# EAGLE design Un_Battery_V2.1 (EAGLE 7.1.0)
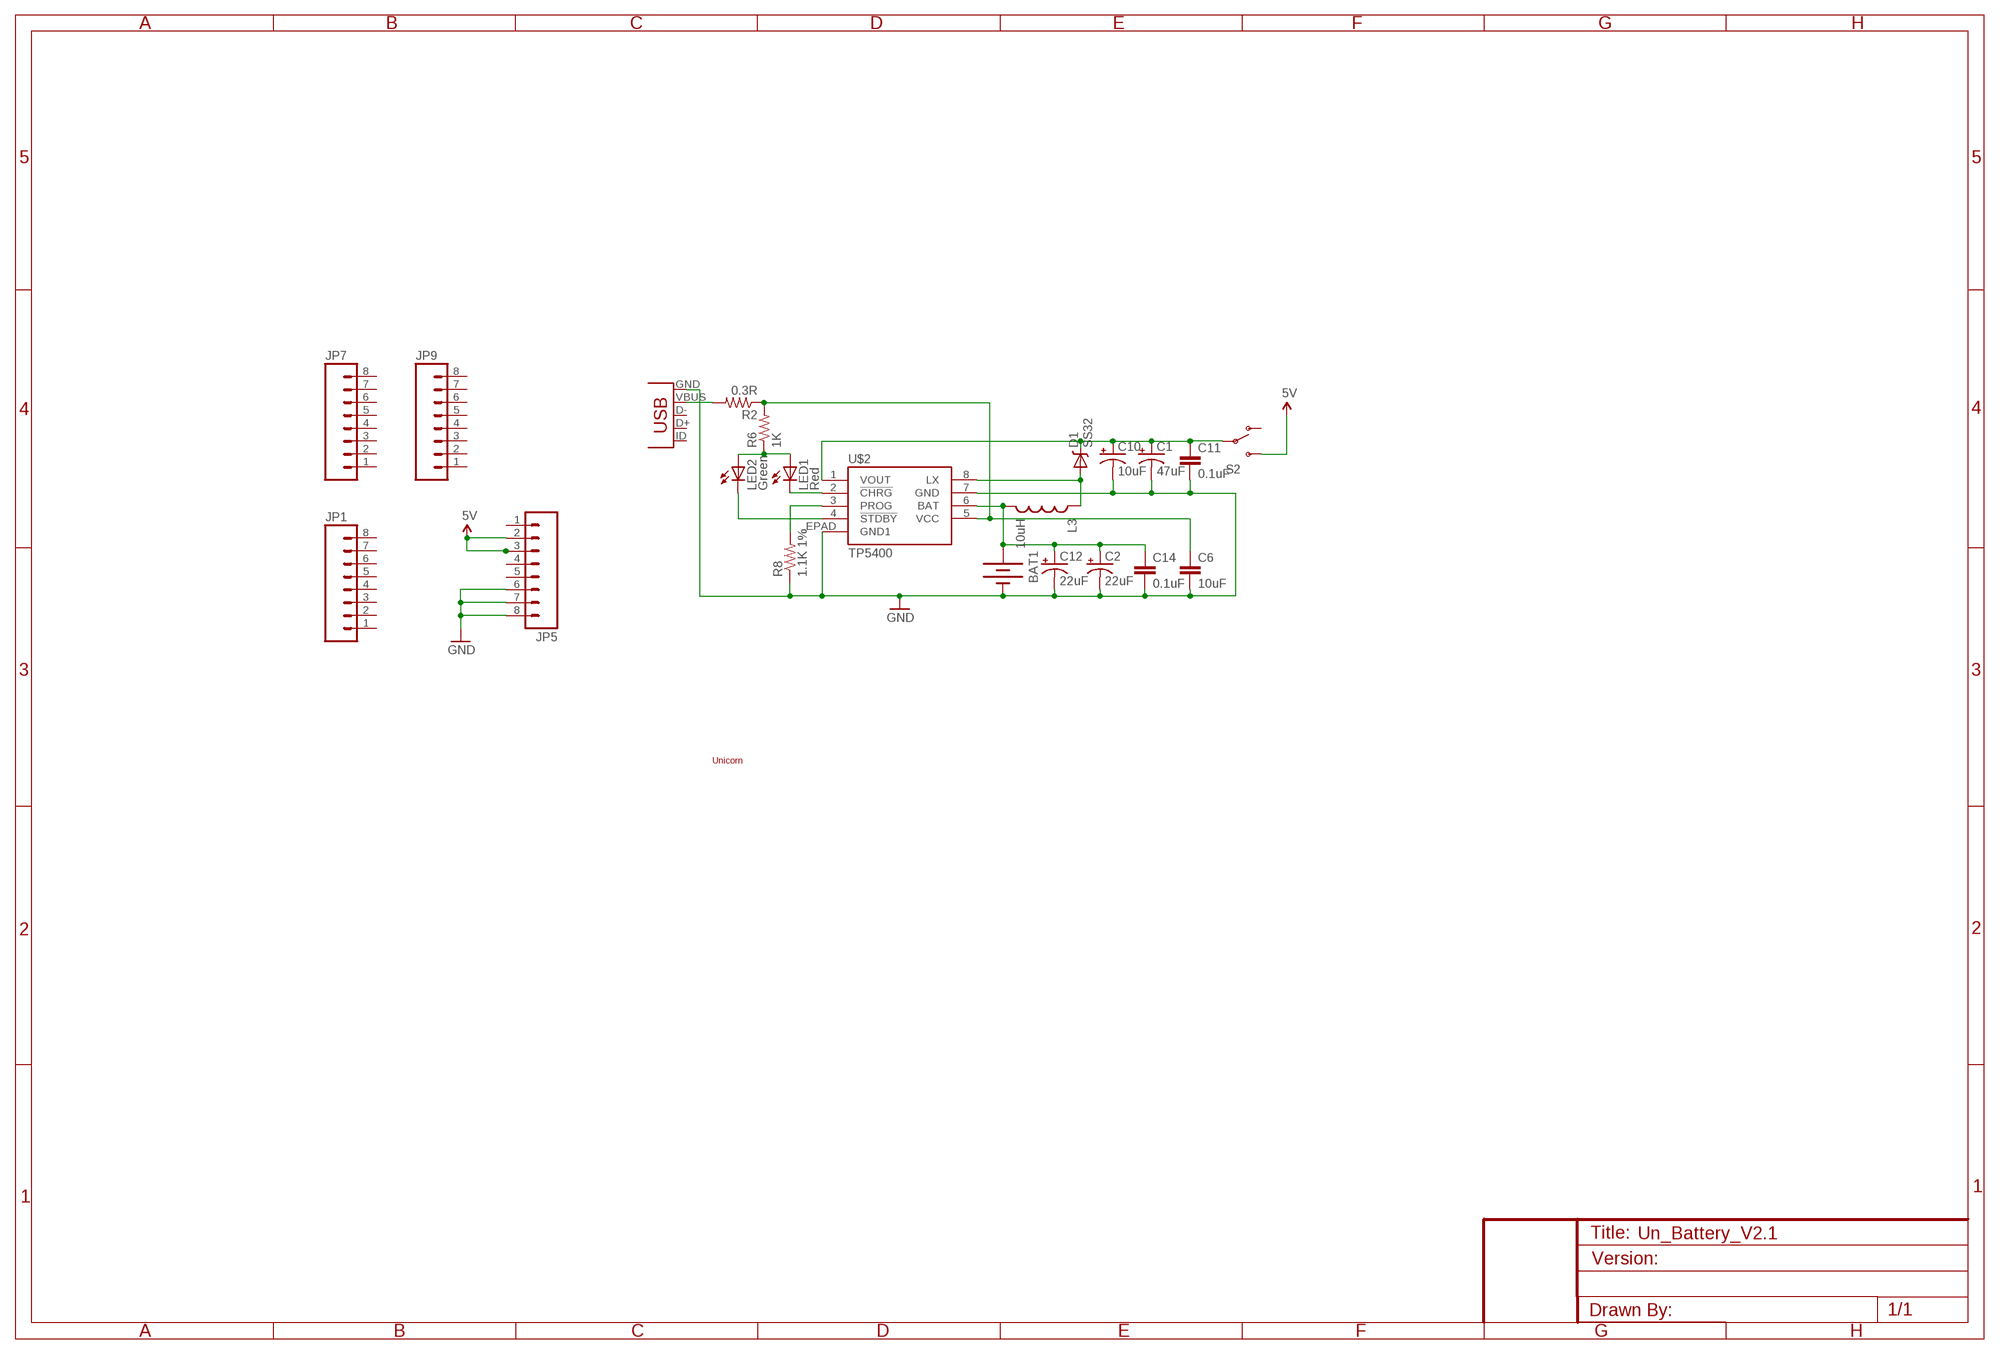
[diagram p0: schematic, sheet 1]

## Parts
BAT1  BATTERYLIPO2  [BATTERY-LIPO2]
C1  47uF  CAP_POL1206  [EIA3216]
C2  22uF  CAP_POL1206  [EIA3216]
C6  10uF  CAP1206  [1206]
C10  10uF  CAP_POL1206  [EIA3216]
C11  0.1uF  CAP0603-CAP  [0603-CAP]
C12  22uF  CAP_POL1206  [EIA3216]
C14  0.1uF  CAP0603-CAP  [0603-CAP]
D1  SS32  DIODE-SCHOTTKY_  [SMA-DIODE]
JP1  M081X08  [1X08]
JP5  M081X08  [1X08]
JP7  M081X08  [1X08]
JP9  M081X08  [1X08]
L3  10uH  INDUCTOR_CR32  [CR32]
LED1  Red  LED0603  [LED-0603]
LED2  Green  LED0603  [LED-0603]
R2  0.3R  RESISTOR1206  [1206]
R6  1K  RESISTOR0603-RES  [0603-RES]
R8  1.1K 1%  RESISTOR0603-RES  [0603-RES]
S2  SWITCH-SPST  [SWITCH-SPDT2]
U$2  TP5400  [SO08-EPAD]
U$6  USB_5-SMD  [USB-MINIB]
U$7  UNICORN_1  [UNICORN_1]

## Nets
5V: JP5.2 JP5.3 S2.3(S)
GND: BAT1.- C1.C(-) C2.C(-) C6.2 C10.C(-) C11.2 C12.C(-) C14.2 JP5.6 JP5.7 JP5.8 R8.1 U$2.7(GND) U$2.EPAD(GND1) U$6.GND
N$1: R2.2 U$6.VBUS
N$2: C6.1 R2.1 R6.2 U$2.5(VCC)
N$3: LED1.A LED2.A R6.1
N$5: LED2.C U$2.4(!STDBY)
N$6: LED1.C U$2.2(!CHRG)
N$7: C1.A(+) C10.A(+) C11.1 D1.C S2.2(P) U$2.1(VOUT)
N$12: R8.2 U$2.3(PROG)
N$13: D1.A L3.P$1 U$2.8(LX)
N$19: BAT1.+ C2.A(+) C12.A(+) C14.1 L3.P$2 U$2.6(BAT)
N$28: JP5.1
N$31: JP5.4
Unconnected: JP1.1 JP1.2 JP1.3 JP1.4 JP1.5 JP1.6 JP1.7 JP1.8 JP5.5 JP7.1 JP7.2 JP7.3 JP7.4 JP7.5 JP7.6 JP7.7 JP7.8 JP9.1 JP9.2 JP9.3 JP9.4 JP9.5 JP9.6 JP9.7 JP9.8 S2.1(O) U$6.D+ U$6.D- U$6.ID(USBID)

## Library data of the parts
BAT1 = 2SparkFun:BATTERY: Battery Holders Various common sizes : AA, AAA, 20mm coin cell and 12mm coin cell.
C1 C2 C10 C12 = 2SparkFun:CAP_POL: Capacitor Polarized These are standard SMD and PTH capacitors. Normally 10uF, 47uF, and 100uF in electrolytic and tantalum varieties. Always verify the external diameter of the through hole cap, it varies with capacity, voltage, and manufacturer. The EIA devices should be standard.
C6 C11 C14 = 2SparkFun:CAP: Capacitor Standard 0603 ceramic capacitor, and 0.1" leaded capacitor.
D1 = 2SparkFun:DIODE-SCHOTTKY
JP1 JP5 JP7 JP9 = 2SparkFun:M08: Header 8 Standard 8-pin 0.1" header. Use with straight break away headers (SKU : PRT-00116), right angle break away headers (PRT-00553), swiss pins (PRT-00743), machine pins (PRT-00117), and female headers (PRT-00115).
L3 = 2SparkFun:INDUCTOR: Inductors Basic Inductor/Choke - 0603 and 1206. Footprints are not proven and vary greatly between part numbers.
LED1 LED2 = 2SparkFun:LED: LEDs Standard schematic elements and footprints for 5mm, 3mm, 1206, and 0603 sized LEDs. 5mm - Spark Fun Electronics SKU : COM-00529 (and others)
R2 R6 R8 = 2SparkFun:RESISTOR: Resistor Basic schematic elements and footprints for 0603, 1206, and PTH resistors.
S2 = 2SparkFun:SWITCH-SPST: SPST Switch Simple slide switch. Spark Fun Electronics SKU : COM-00102
U$2 = 2SparkFun:TP5400
U$6 = 2SparkFun:USB_5
U$7 = 2SparkFun:UNICORN

## Net classes
0 default: clearance 0.205 mm
1 power: width 0.61 mm, drill 0.61 mm, clearance 0.254 mm
2 gnd: width 0.305 mm, drill 0.381 mm, clearance 0.254 mm
3 usbvcc: width 0.508 mm, drill 0.61 mm, clearance 0.254 mm
4 aref: width 0.406 mm, drill 0.61 mm, clearance 0.254 mm

## Board
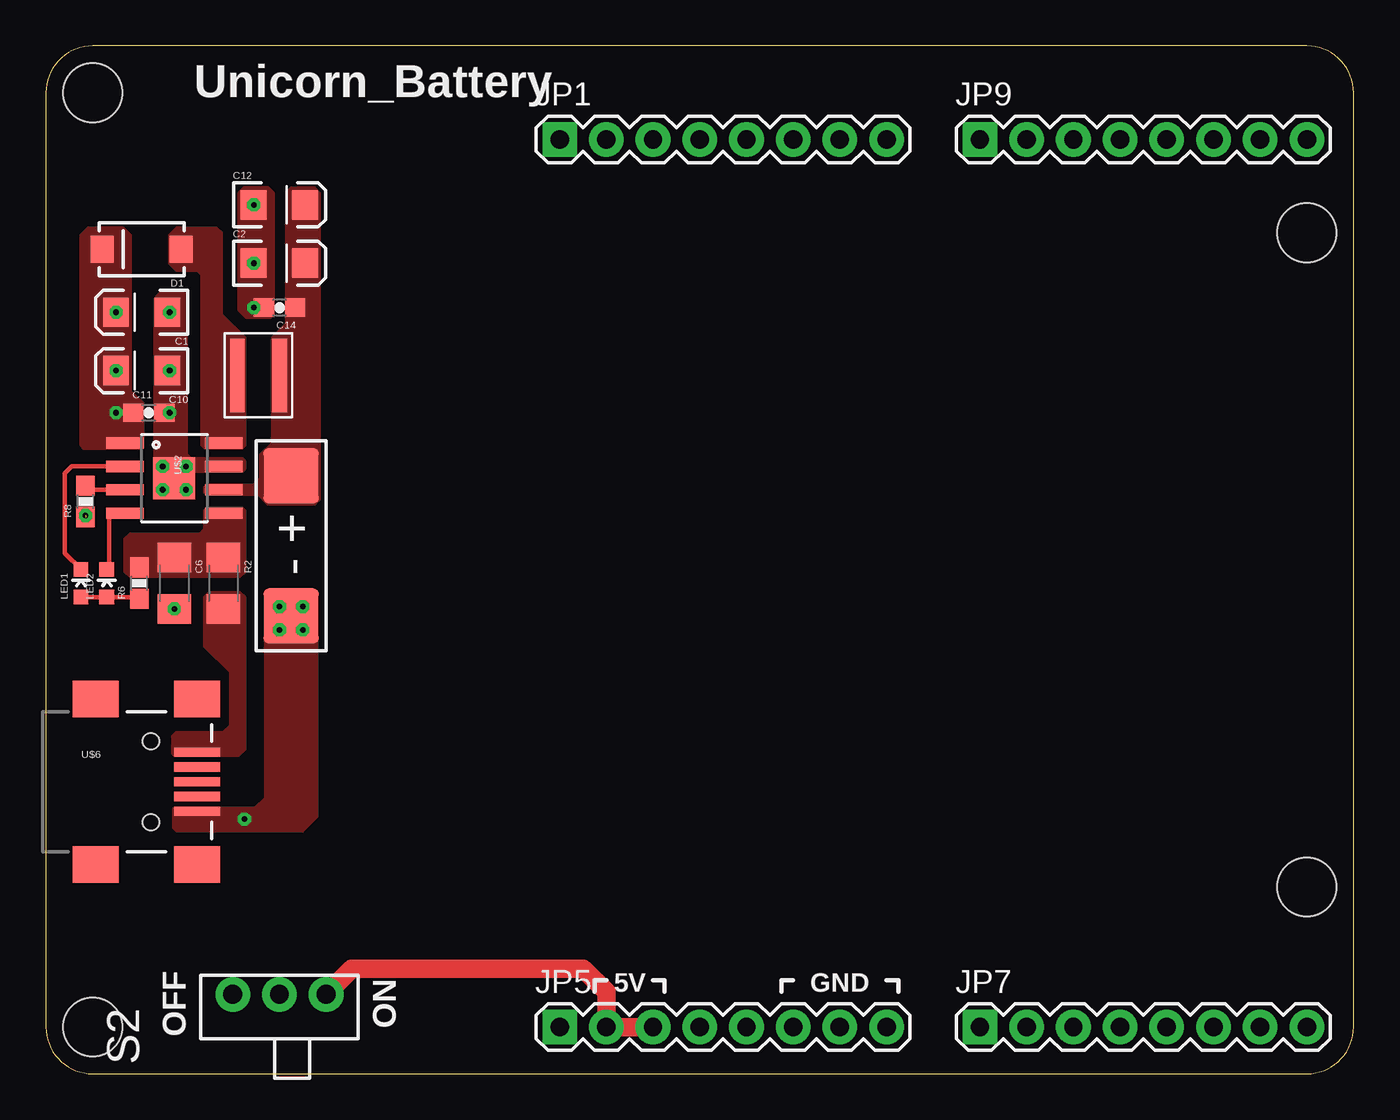
[diagram p1: board, top side]
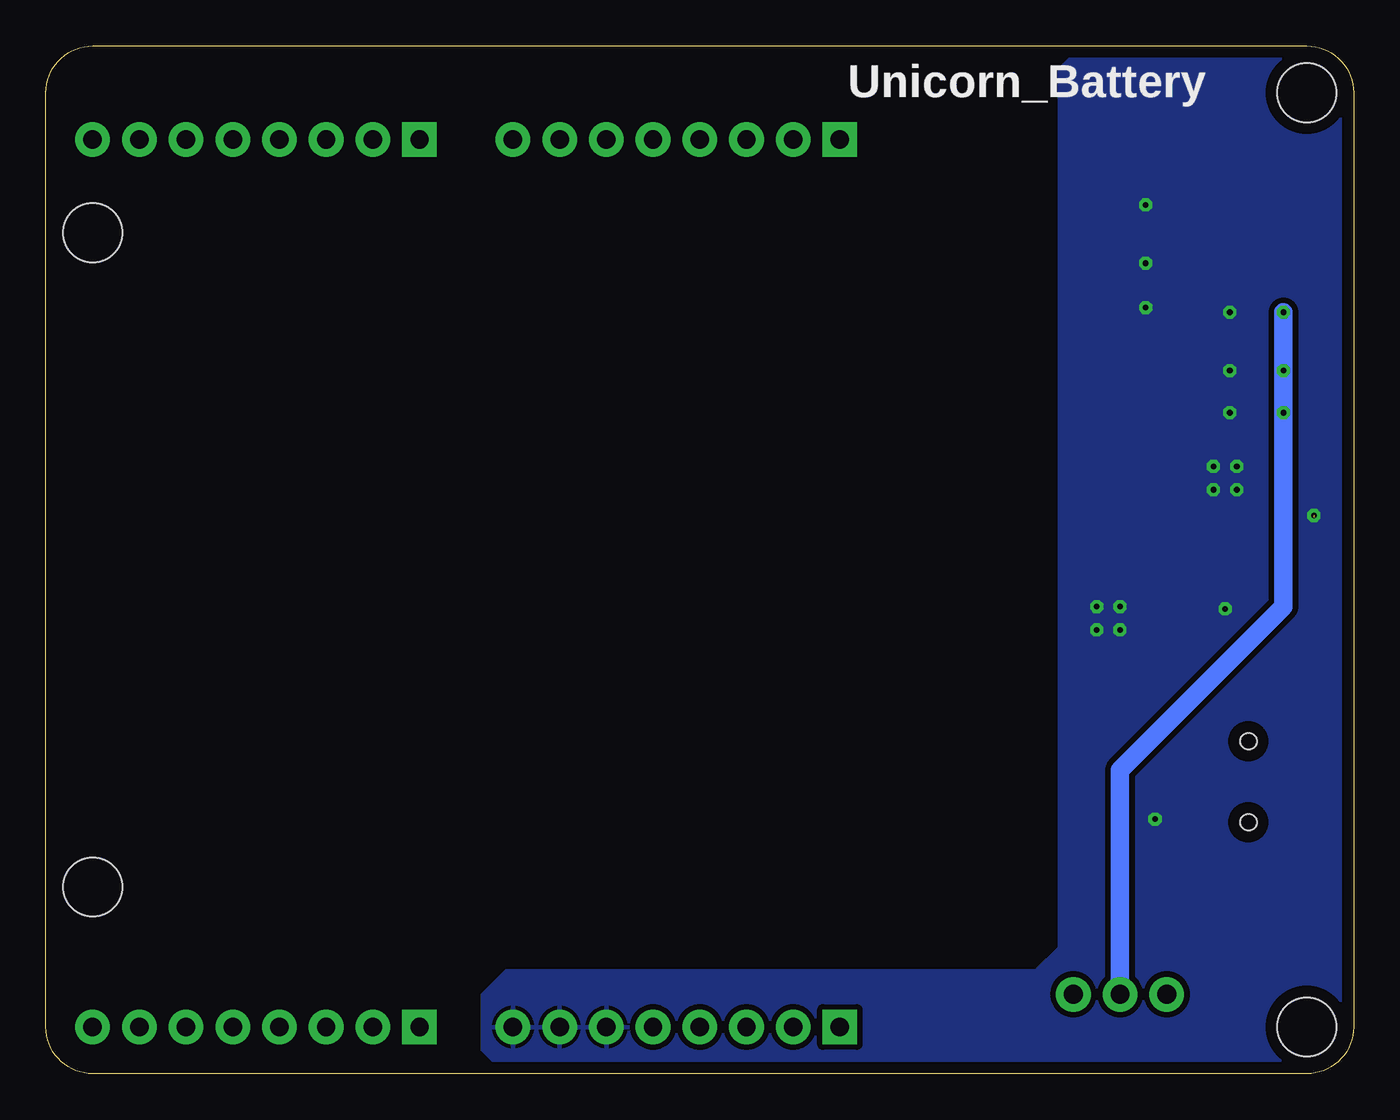
[diagram p2: board, bottom side, seen from below]

Size 71.12 x 55.88 mm. Coordinates in mm from the lower left corner, seen from the top.
Copper layers (1*16): Top 0.035mm / dielectric 1.5mm / Bottom 0.035mm
Design rules "yun": minimum track width 8mil, minimum drill 15mil, track to track 8mil, track to pad 8mil, pad to pad 8mil, via to via 8mil, smd to smd 8mil, copper to edge 25mil, drill to drill 8mil, minimum pad ring 10mil, minimum via ring 8mil, stop-mask expansion 4mil, vias tented up to drill 20mil, thermal gap 8mil

### Footprints (pad centres in the part's own frame; a part is rotated, then mirrored left to right if it is on the bottom)
BATTERY-LIPO2 = smd 3 x 3: + -3.81,0; - 3.81,0
EIA3216 = smd 1.4 x 1.6: A 1.4,0; C -1.4,0
1206 = smd 1.6 x 1.8: 1 -1.4,0; 2 1.4,0
0603-CAP = smd 1.1 x 1: 1 -0.85,0; 2 0.85,0
SMA-DIODE = smd 1.27 x 1.47: A -2.15,0; C 2.15,0
1X08 = drill 1 pad 1.88 square: 1 0,0 | drill 1 pad 1.88: 2 2.54,0; 3 5.08,0; 4 7.62,0; 5 10.16,0; 6 12.7,0; 7 15.24,0; 8 17.78,0
CR32 = smd 0.8 x 4: P$1 -1.15,0; P$2 1.15,0
LED-0603 = smd 0.8 x 0.8: A 0,-0.75; C 0,0.75
0603-RES = smd 1.1 x 1: 1 -0.85,0; 2 0.85,0
SWITCH-SPDT2 = drill 1.016 pad 1.88: 1 0,2.54; 2 0,0; 3 0,-2.54
SO08-EPAD = smd 0.61 x 2.057: 1 -1.905,-2.692; 2 -0.635,-2.692; 3 0.635,-2.692; 4 1.905,-2.692; 5 1.905,2.692; 6 0.635,2.692; 7 -0.635,2.692; 8 -1.905,2.692 | smd 2.286 x 2.286: EPAD 0,0
USB-MINIB = smd 2.5 x 0.5: D+ 2.5,0; D- 2.5,0.8; GND 2.5,-1.6; ID 2.5,-0.8; VBUS 2.5,1.6 | smd 2.5 x 2: MTN1 -3,4.5; MTN2 2.5,4.5; MTN3 -3,-4.5; MTN4 2.5,-4.5 | hole 0.9: 0,2.2; 0,-2.2
UNICORN_1 = hole 3.2: -33.02,-25.4; 33.02,17.78; 33.02,-17.78; -33.02,25.4

### Placement (x,y rotation side)
BAT1  13.33,28.7 270 top
C1  5.21,41.4 180 top
C2  12.7,44.07 0 top
C6  6.98,26.67 270 top
C10  5.21,38.23 180 top
C11  5.59,35.94 0 top
C12  12.7,47.24 0 top
C14  12.7,41.66 180 top
D1  5.21,44.83 180 top
JP1  27.94,50.8 0 top
JP5  27.94,2.54 0 top
JP7  50.8,2.54 0 top
JP9  50.8,50.8 0 top
L3  11.56,37.97 0 top
LED1  1.91,26.67 0 top
LED2  3.3,26.67 0 top
R2  9.65,26.67 270 top
R6  5.08,26.67 90 top
R8  2.16,31.11 90 top
S2  12.7,4.32 90 top
U$2  6.98,32.38 270 top
U$6  5.72,15.88 0 top
U$7  35.56,27.94 0 top

### Tracks (layer width: path | path; a pad name or v marks a point on that pad's centre or on a via)
5V
  Top 1.016: JP5.3 JP5.2 30.48,4.45 29.21,5.71 16.64,5.71 S2.3
GND  (via drill 0.3)  (2 unrouted)
  other vias: 12.7,25.4 12.7,24.13 13.97,24.13 13.97,25.4 6.35,33.02 6.73,38.23 6.73,35.94 6.98,25.27 7.62,33.02 7.62,31.75 6.35,31.75 6.73,41.4 11.3,47.24 11.3,44.07 2.16,30.35 10.8,13.84 11.3,41.66
  pour Bottom (isolate 0.305, rank 2): 0,55.88 14.73,55.88 16,54.61 16,6.86 17.27,5.59 46.1,5.59 47.37,4.32 47.37,1.27 46.1,0 0,0
  pour Top (isolate 0.305, no thermals): 8,32.77 6.98,31.37 8,31.37
  pour Top (isolate 0.305, no thermals): 7.62,33.68 7.87,33.43 10.67,33.43 10.8,33.3 10.8,32.89 10.67,32.77 6.6,32.77 6.35,33.02 5.94,33.5 5.94,42.14 6.3,42.55 7.37,42.55 7.62,42.29
  pour Top (isolate 0.305, no thermals): 10.92,41.15 10.54,41.53 10.54,47.88 10.8,48.13 12.06,48.13 12.32,47.88 12.32,41.27 12.19,41.15
  pour Top (isolate 0.305, no thermals): 11.94,14.99 11.94,26.04 12.19,26.29 14.48,26.29 14.73,26.04 14.73,13.97 13.97,13.21 7.11,13.21 6.93,13.39 6.93,14.38 6.98,14.43 11.38,14.43
N$1
  pour Top (isolate 0.305, no thermals): 10.8,17.65 10.8,25.91 10.54,26.16 8.89,26.16 8.64,25.91 8.64,23.24 10.03,21.84 10.03,18.92 9.65,18.54 7.09,18.54 6.88,18.34 6.88,17.42 6.98,17.32 10.46,17.32
N$2
  pour Top (isolate 0.305, no thermals): 4.57,27.05 10.54,27.05 10.8,27.3 10.8,30.61 10.67,30.73 8.76,30.73 8.64,30.61 8.64,29.59 8.38,29.34 4.57,29.34 4.32,29.08 4.32,27.3
N$3
  Top 0.254: LED1.A LED2.A 4.98,25.92 R6.1
N$5
  Top 0.254: LED2.C 3.43,27.67 3.43,30.48 U$2.4
N$6
  Top 0.254: U$2.2 1.4,33.02 1.02,32.64 1.02,28.31 LED1.C
N$7  (via drill 0.3)
  Top 1.016: C1.A 3.68,41.27 C1.A
  Bottom 1.016: C1.A 3.81,25.4 12.7,16.51 S2.2
  other vias: 3.81,35.94 3.81,38.23 3.81,41.4
  pour Top (isolate 0.305, no thermals): 2.29,45.97 1.91,45.59 1.91,34.16 2.06,34.01 5.21,34.01 5.26,34.06 5.26,36.45 4.57,37.08 4.57,45.59 4.19,45.97
N$12
  Top 0.254: U$2.3 2.25,31.75 R8.2
N$13
  pour Top (isolate 0.305, no thermals): 8.64,34.04 10.67,34.04 10.8,34.16 10.8,40.01 9.53,41.27 9.53,45.72 9.27,45.97 7.11,45.97 6.73,45.59 6.73,44.07 7.11,43.69 8.25,43.69 8.51,43.43 8.51,34.16
N$19
  pour Top (isolate 0.305, no thermals): 14.61,48.13 13.33,48.13 13.08,47.88 13.08,40.77 12.32,40.01 12.32,34.29 11.68,33.66 11.68,32.38 11.3,32 8.76,32 8.64,31.88 8.64,31.62 8.76,31.5 11.56,31.5 12.06,30.99 14.61,30.99 14.86,31.24 14.86,47.88

### Text on the board
tPlace: Unicorn_Battery | OFF | ON | 5V | GND
bPlace: Unicorn_Battery